# Altium schematic sheet ultrasonic.SchDoc: Ultrasonic
size Letter; Author: Kuo, Huang; Revision: 2.0; SheetNumber: 2; SheetTotal: 7
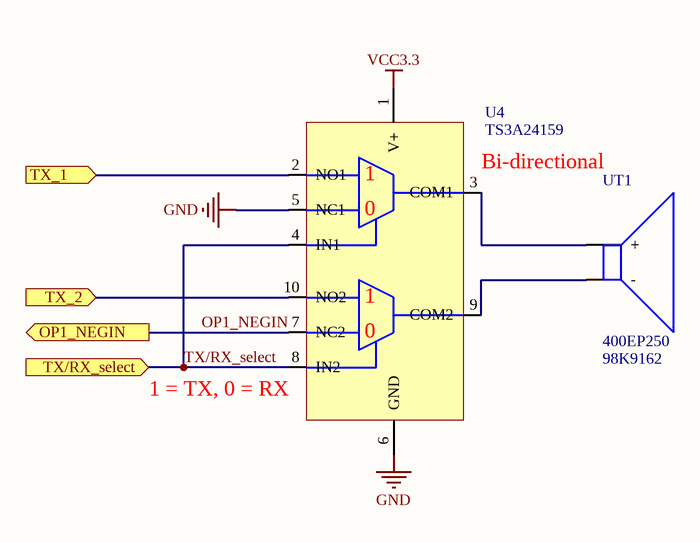
[diagram p0: ultrasonic.SchDoc]

## Parts
U4  TS3A24159  [TSSOP50P490X110-10N]
UT1  400EP250  Supplier Part Number 1: 98K9162  [Transducer recepticle]

## Ports
OP1_NEGIN (out), TX/RX_select (in), TX_1 (in), TX_2 (in)

## Nets
GND: U4.5(NC1) U4.6(GND)
VCC3.3: U4.1(V+)
OP1_NEGIN: U4.7(NC2) ; port OP1_NEGIN
TX/RX_select: U4.4(IN1) U4.8(IN2) ; port TX/RX_select
TX_1: U4.2(NO1) ; port TX_1
TX_2: U4.10(NO2) ; port TX_2
NetU4_3: U4.3(COM1) UT1.2(+)
NetU4_9: U4.9(COM2) UT1.1(-)

## Notes on the sheet
- (near U4) Bi-directional
- (near U4) 1 = TX, 0 = RX
- Title
- Date:
- Author:
- Revision:
- Sheet
- of
- University of Michigan
- File:
- (in symbol TS3A24159) 0

## Library data of the parts
U4 = TS3A24159: DUAL-CHANNEL 2:1 MULTIPLEXER/DEMULTIPLEXER; Supplier 1: Digi-Key; Supplier Part Number 1: 296-21913-1-ND
UT1 = Tranducer: Air Ultrasounic Ceramic Transducers; Supplier 1: Newark